# EAGLE schematic trans-emu (EAGLE 9.6.2)
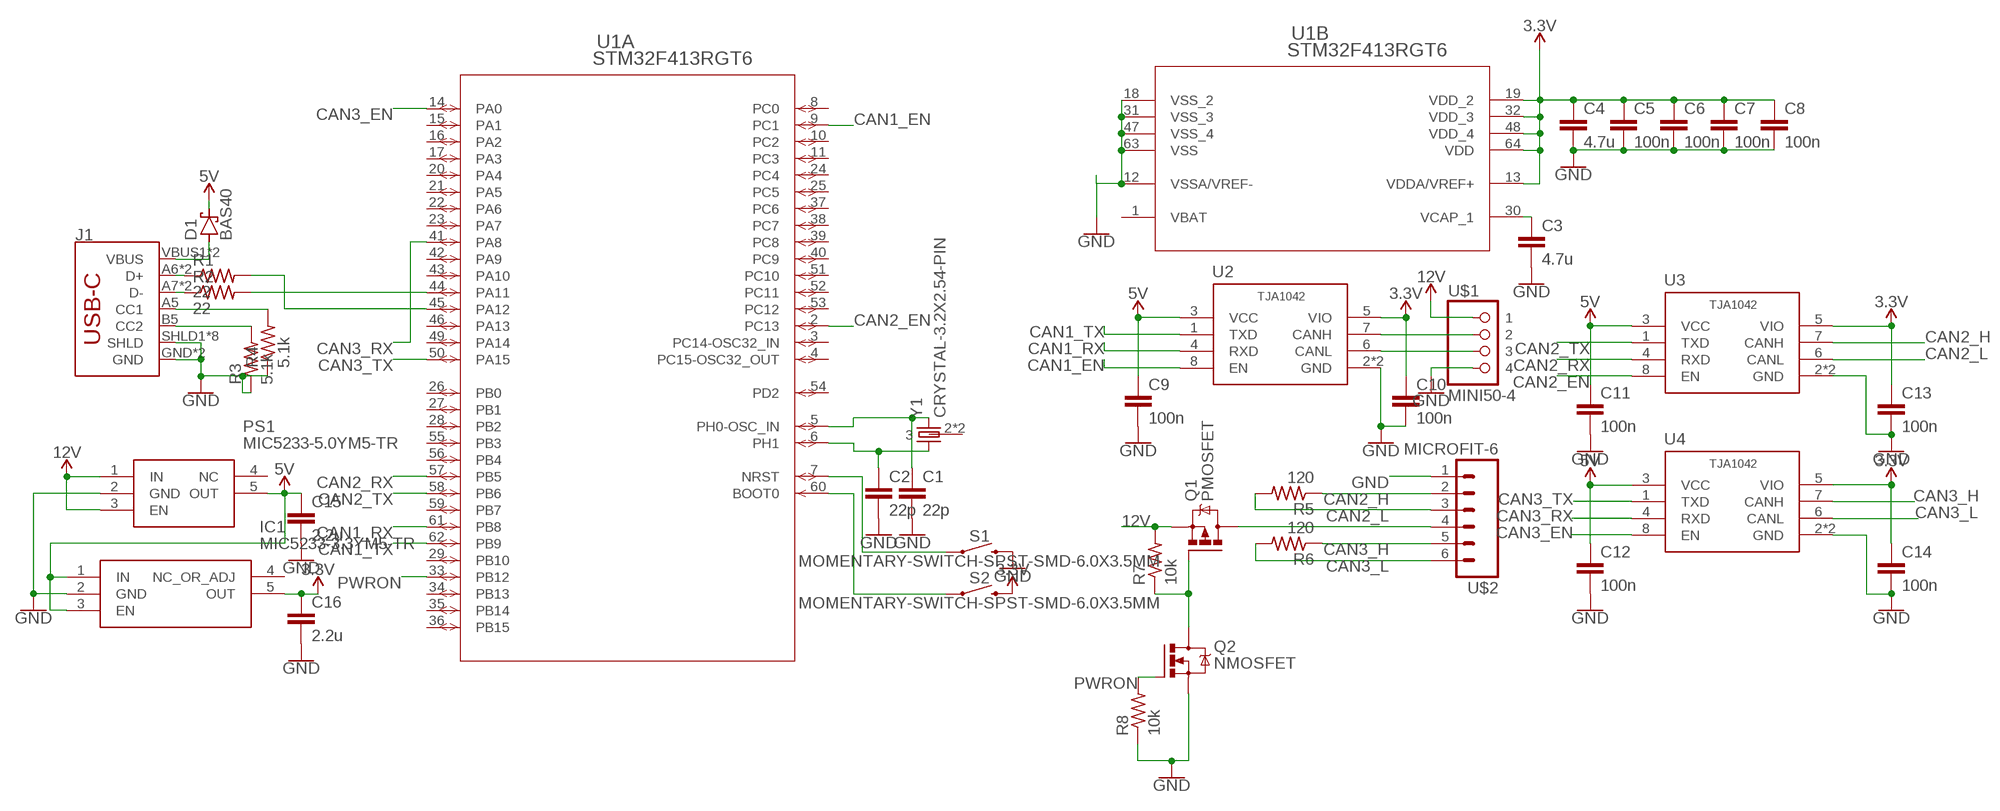
[diagram p0: schematic, sheet 1]

## Parts
C1  22p  C0603  [0603-C]
C2  22p  C0603  [0603-C]
C3  4.7u  C0603  [0603-C]
C4  4.7u  C0603  [0603-C]
C5  100n  C0603  [0603-C]
C6  100n  C0603  [0603-C]
C7  100n  C0603  [0603-C]
C8  100n  C0603  [0603-C]
C9  100n  C0603  [0603-C]
C10  100n  C0603  [0603-C]
C11  100n  C0603  [0603-C]
C12  100n  C0603  [0603-C]
C13  100n  C0603  [0603-C]
C14  100n  C0603  [0603-C]
C15  2.2u  C0603  [0603-C]
C16  2.2u  C0603  [0603-C]
D1  BAS40  [SOT23]
IC1  MIC5233-3.3YM5-TR  [SOT95P280X145-5N]
J1  USB-C-BREAKOUT_SPARKFUN-CONNECTORS_USB_C16PIN  [USB-C-BREAKOUT_SPARKFUN-CONNECTORS_USB-C-16P]
PS1  MIC5233-5.0YM5-TR  [SOT95P280X145-5N]
Q1  PMOSFET  PMOSFET_SOT23  [SOT23]
Q2  NMOSFET  NMOSFETSOT23  [SOT23]
R1  22  R0402  [0402-R]
R2  22  R0402  [0402-R]
R3  5.1k  R0402  [0402-R]
R4  5.1k  R0402  [0402-R]
R5  120  R0402  [0402-R]
R6  120  R0402  [0402-R]
R7  10k  R0402  [0402-R]
R8  10k  R0402  [0402-R]
S1  MOMENTARY-SWITCH-SPST-SMD-6.0X3.5MM  [TACTILE_SWITCH_SMD_6.0X3.5MM]
S2  MOMENTARY-SWITCH-SPST-SMD-6.0X3.5MM  [TACTILE_SWITCH_SMD_6.0X3.5MM]
U1  STM32F413RGT6  [LQFP64-10X10MM]
U2  TJA1042HVSON  [HVSON8]
U3  TJA1042HVSON  [HVSON8]
U4  TJA1042HVSON  [HVSON8]
U$1  MINI50-4  [MINI50]
U$2  MICROFIT-6  [MICROFIT-6]
Y1  CRYSTAL-3.2X2.54-PIN  [XTAL-3.2X2.5]

## Nets
3.3V: C4.1 C5.1 C6.1 C7.1 C8.1 C10.1 C13.1 C14.1 C16.1 IC1.5(OUT) S2.2 U1.13(B:VDDA/VREF+) U1.19(B:VDD_2) U1.32(B:VDD_3) U1.48(B:VDD_4) U1.64(B:VDD) U2.5(VIO) U3.5(VIO) U4.5(VIO)
5V: C9.1 C11.1 C12.1 C15.1 D1.3(C) IC1.1(IN) IC1.3(EN) PS1.5(OUT) U2.3(VCC) U3.3(VCC) U4.3(VCC)
12V: PS1.1(IN) PS1.3(EN) Q1.2(S) R7.2 U$1.4
CAN1_EN: U1.9(A:PC1) U2.8(EN)
CAN1_RX: U1.61(A:PB8) U2.4(RXD)
CAN1_TX: U1.62(A:PB9) U2.1(TXD)
CAN2_EN: U1.2(A:PC13) U3.8(EN)
CAN2_H: R5.1 U3.7(CANH) U$2.2
CAN2_L: R5.2 U3.6(CANL) U$2.3
CAN2_RX: U1.57(A:PB5) U3.4(RXD)
CAN2_TX: U1.58(A:PB6) U3.1(TXD)
CAN3_EN: U1.14(A:PA0) U4.8(EN)
CAN3_H: R6.1 U4.7(CANH) U$2.5
CAN3_L: R6.2 U4.6(CANL) U$2.6
CAN3_RX: U1.41(A:PA8) U4.4(RXD)
CAN3_TX: U1.50(A:PA15) U4.1(TXD)
GND: C1.2 C2.2 C3.2 C4.2 C5.2 C6.2 C7.2 C8.2 C9.2 C10.2 C11.2 C12.2 C13.2 C14.2 C15.2 C16.2 IC1.2(GND) J1.GND J1.GND2(GND) J1.SHLD1(SHLD) J1.SHLD2(SHLD) J1.SHLD3(SHLD) J1.SHLD4(SHLD) J1.SHLD5(SHLD) J1.SHLD6(SHLD) J1.SHLD7(SHLD) J1.SHLD8(SHLD) PS1.2(GND) Q2.2(S) R3.1 R4.1 R8.1 S1.2 U1.12(B:VSSA/VREF-) U1.18(B:VSS_2) U1.31(B:VSS_3) U1.47(B:VSS_4) U1.63(B:VSS) U2.2(GND) U2.PAD(GND) U3.2(GND) U3.PAD(GND) U4.2(GND) U4.PAD(GND) U$1.1 U$2.1
N$1: C1.1 U1.5(A:PH0-OSC_IN) Y1.3
N$2: C2.1 U1.6(A:PH1) Y1.1
N$3: R2.2 U1.44(A:PA11)
N$4: R1.2 U1.45(A:PA12)
N$5: D1.1(A) J1.VBUS1(VBUS) J1.VBUS2(VBUS)
N$6: J1.A5(CC1) R4.2
N$7: J1.B5(CC2) R3.2
N$8: S1.1 U1.7(A:NRST)
N$9: S2.1 U1.60(A:BOOT0)
N$10: J1.A6(D+) J1.B6(D+) R1.1
N$11: J1.A7(D-) J1.B7(D-) R2.1
N$12: U2.7(CANH) U$1.3
N$13: C3.1 U1.30(B:VCAP_1)
N$14: U2.6(CANL) U$1.2
N$15: Q1.3(D) U$2.4
N$16: Q1.1(G) Q2.3(D) R7.1
PWRON: Q2.1(G) R8.2 U1.33(A:PB12)
Unconnected: IC1.4(NC_OR_ADJ) PS1.4(NC) U1.3(A:PC14-OSC32_IN) U1.4(A:PC15-OSC32_OUT) U1.8(A:PC0) U1.10(A:PC2) U1.11(A:PC3) U1.15(A:PA1) U1.16(A:PA2) U1.17(A:PA3) U1.20(A:PA4) U1.21(A:PA5) U1.22(A:PA6) U1.23(A:PA7) U1.24(A:PC4) U1.25(A:PC5) U1.26(A:PB0) U1.27(A:PB1) U1.28(A:PB2) U1.29(A:PB10) U1.34(A:PB13) U1.35(A:PB14) U1.36(A:PB15) U1.37(A:PC6) U1.38(A:PC7) U1.39(A:PC8) U1.40(A:PC9) U1.42(A:PA9) U1.43(A:PA10) U1.46(A:PA13) U1.49(A:PA14) U1.51(A:PC10) U1.52(A:PC11) U1.53(A:PC12) U1.54(A:PD2) U1.55(A:PB3) U1.56(A:PB4) U1.59(A:PB7) Y1.2 Y1.4

## Power pins joined to a net without a drawn wire
VBAT: U1.1(B:VBAT)

## Library data of the parts
C1-C16 = comma.ai:C
D1 = diode:BAS40: Silicon Schottky Diodes General-purpose diode for high-speed switching
IC1 = SamacSys_Parts:MIC5233-3.3YM5-TR: High Input Voltage Low IQ UCAP LDO Regulator Source: Datasheet <http://ww1.microchip.com/downloads/en/DeviceDoc/MIC5233-Data-Sheet-DS20006033D.pdf>; DESCRIPTION: High Input Voltage Low IQ UCAP LDO Regulator; HEIGHT: 1.45mm; MANUFACTURER_NAME: Microchip; MANUFACTURER_PART_NUMBER: MIC5233-3.3YM5-TR; MOUSER_PART_NUMBER: 998-MIC5233-3.3YM5TR; MOUSER_PRICE-STOCK: https://www.mouser.co.uk/ProductDetail/Microchip-Technology-Micrel/MIC5233-33YM5-TR?qs=U6T8BxXiZAWDhshLMgpaLQ%3D%3D
J1 = ROTR-Wireless:USB-C-BREAKOUT_SPARKFUN-CONNECTORS_USB_C: USB Type C 16Pin Connector Super Speed pins not available on the 16-pin purely SMD connector so this part is best for USB 2.0 implementations. D1 and D2 are tied together enabling D+/- no matter which way the cable is plugged into the connector. The two channel configuration pins (CC1/2) are exposed. These are normally connected to ground via 5.1k resistors but can be reconfigured for high current/high power applications.; PROD_ID: CONN-14122
PS1 = SamacSys_Parts:MIC5233-5.0YM5-TR: MICROCHIP - MIC5233-5.0YM5-TR - LDO, REG, 36VIN, 0.1A, 5V, 2%, 5SOT23 Source: Datasheet <https://componentsearchengine.com/Datasheets/2/MIC5233-5.0YM5-TR.pdf>; DESCRIPTION: MICROCHIP - MIC5233-5.0YM5-TR - LDO, REG, 36VIN, 0.1A, 5V, 2%, 5SOT23; HEIGHT: 1.45mm; MANUFACTURER_NAME: Microchip; MANUFACTURER_PART_NUMBER: MIC5233-5.0YM5-TR; MOUSER_PART_NUMBER: 998-MIC5233-5.0YM5TR; MOUSER_PRICE-STOCK: https://www.mouser.co.uk/ProductDetail/Microchip-Technology-Micrel/MIC5233-50YM5-TR?qs=U6T8BxXiZAWSnpCHgrMajw%3D%3D
Q1 = Transistor:PMOSFET: P-Channel MOSFET - Generic; CATEGORY: Transistor; SUB-CATEGORY: MOSFET; TYPE: P-Channel
Q2 = Transistor:NMOSFET: N-Channel MOSFET - Generic; CATEGORY: Transistor; SUB-CATEGORY: MOSFET; TYPE: N-Channel
R1-R8 = comma.ai:R
S1 S2 = SparkFun-Switches:MOMENTARY-SWITCH-SPST: Momentary Switch (Pushbutton) - SPST Normally-open (NO) SPST momentary switches (buttons, pushbuttons). Variants PTH-12MM - 12mm square, through-hole Momentary Pushbutton Switch - 12mm Square <https://www.sparkfun.com/products/9190> (COM-09190) PTH-6.0MM, PTH-6.0MM-KIT - 6.0mm square, through-hole Mini Pushbutton Switch <https://www.sparkfun.com/products/97> (COM-00097) KIT package intended for soldering kit's - only one side of pads' copper is exposed. PTH-RIGHT-ANGLE-KIT - Right-angle, through-hole Right Angle Tactile Button <https://www.sparkfun.com/products/10791> - Used on SparkFun BigTime Watch Kit <https://www.sparkfun.com/products/11734> SMD-12MM - 12mm square, surface-mount Tactile Button - SMD (12mm) <https://www.sparkfun.com/products/12993> (COM-12993) Used on SparkFun PicoBoard <https://www.sparkfun.com/products/11888> SMD-4.5MM - 4.5mm Square Trackball Switch Used on SparkFun Blackberry Trackballer Breakout <https://www.sparkfun.com/products/13169> SMD-4.6MMX2.8MM - 4.60mm x 2.80mm, surface mount Used on SparkFun SAMD21 Mini Breakout <https://www.sparkfun.com/products/13664> SMD-5.2MM, SMD-5.2-REDUNDANT - 5.2mm square, surface-mount Mini Pushbutton Switch - SMD <https://www.sparkfun.com/products/8720> (COM-08720) Used on Arduino Pro Mini <https://www.sparkfun.com/products/11114> REDUNDANT package connects both switch circuits together SMD-6.0X3.5MM - 6.0 x 3.5mm, surface mount Momentary Reset Switch SMD <https://www.sparkfun.com/products/8229> (COM-08229) SMD-6.2MM-TALL - 6.2mm square, surface mount Tactile Button - SMD (6mm) <https://www.sparkfun.com/products/12992> Used on SparkFun Digital Sandbox <https://www.sparkfun.com/products/12651> SMD-RIGHT-ANGLE - Right-angle, surface mount Used on SparkFun Block for Intel® Edison - Arduino <https://www.sparkfun.com/products/13036>; PROD_ID: SWCH-00815; SF_SKU: COM-08229
U1 = interceptor:STM32F413RGT6; BUILT_BY: EMA_UL_Team; COPYRIGHT: Copyright (C) 2018 Accelerated Designs. All rights reserved; MANUFACTURER_PART_NUMBER: STM32F413RGT6; SOURCELIBRARY: Updates_to_database_2020-10-19; VENDOR: STMicroelectronics
U2-U4 = comma.ai:TJA1042
U$1 = interceptor:MINI50-4
U$2 = interceptor:MICROFIT-6
Y1 = comma.ai:CRYSTAL-3.2X2.5